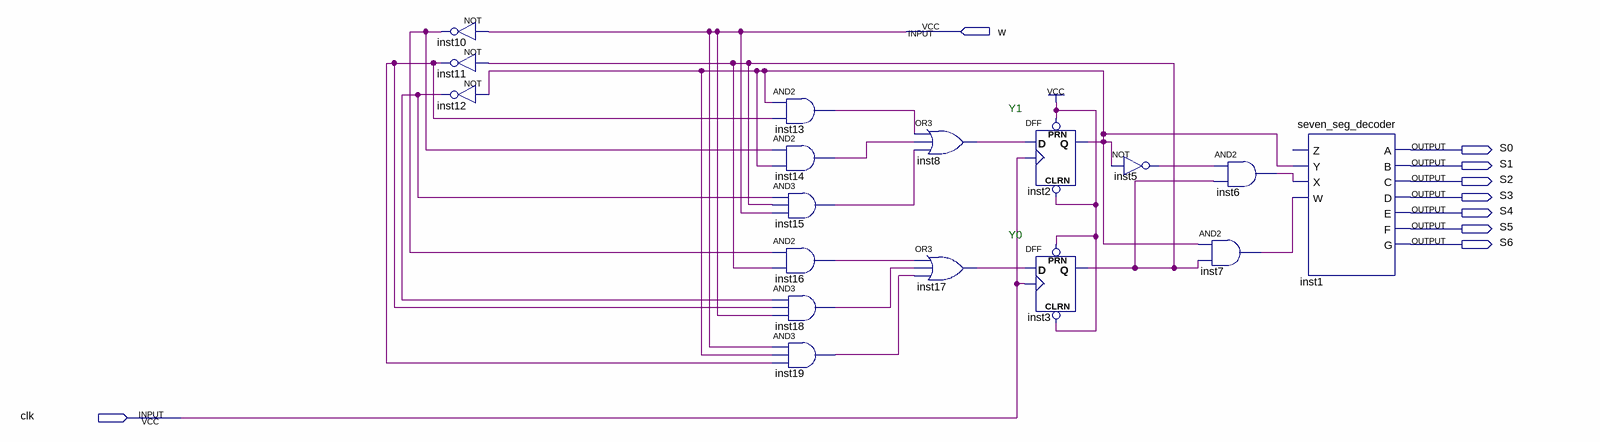
[diagram p0: schematic sheet]
// Quartus schematic lab11step2.bdf as structural Verilog: 17 symbols, 9 pins
module lab11step2 (
  input  w,
  input  clk,
  output S0,
  output S1,
  output S2,
  output S3,
  output S4,
  output S5,
  output S6
);

  wire inst2_q, inst3_q, inst5_out, inst6_out, inst7_out, inst8_out, inst10_out, inst11_out, inst12_out,
       inst13_out, inst14_out, inst15_out, inst16_out, inst17_out, inst18_out, inst19_out;

  not inst10 (inst10_out, w);
  not inst11 (inst11_out, inst3_q);
  not inst12 (inst12_out, inst2_q);
  and inst13 (inst13_out, inst2_q, inst11_out);
  and inst14 (inst14_out, inst10_out, inst2_q);
  and inst15 (inst15_out, inst12_out, inst3_q, w);
  and inst16 (inst16_out, inst10_out, inst3_q);
  and inst18 (inst18_out, inst12_out, inst11_out, w);
  and inst19 (inst19_out, w, inst2_q, inst11_out);
  or inst8 (inst8_out, inst13_out, inst14_out, inst15_out);
  or inst17 (inst17_out, inst16_out, inst18_out, inst19_out);
  DFF inst2 (.CLRN(1'b1), .CLK(clk), .D(inst8_out), .PRN(1'b1), .Q(inst2_q));
  DFF inst3 (.CLRN(1'b1), .CLK(clk), .D(inst17_out), .PRN(1'b1), .Q(inst3_q));
  not inst5 (inst5_out, inst2_q);
  and inst6 (inst6_out, inst5_out, inst3_q);
  and inst7 (inst7_out, inst2_q, inst3_q);
  seven_seg_decoder inst1 (
    .Y(inst2_q), .X(inst6_out), .W(inst7_out), .A(S0), .B(S1), .C(S2), .D(S3), .E(S4), .F(S5), .G(S6));  // open: Z

  // Notes on the sheet:
  //   Y1
  //   Y0
endmodule
